# Altium schematic sheet P11_ETH1 RMII.SchDoc
size 420 x 297 mm
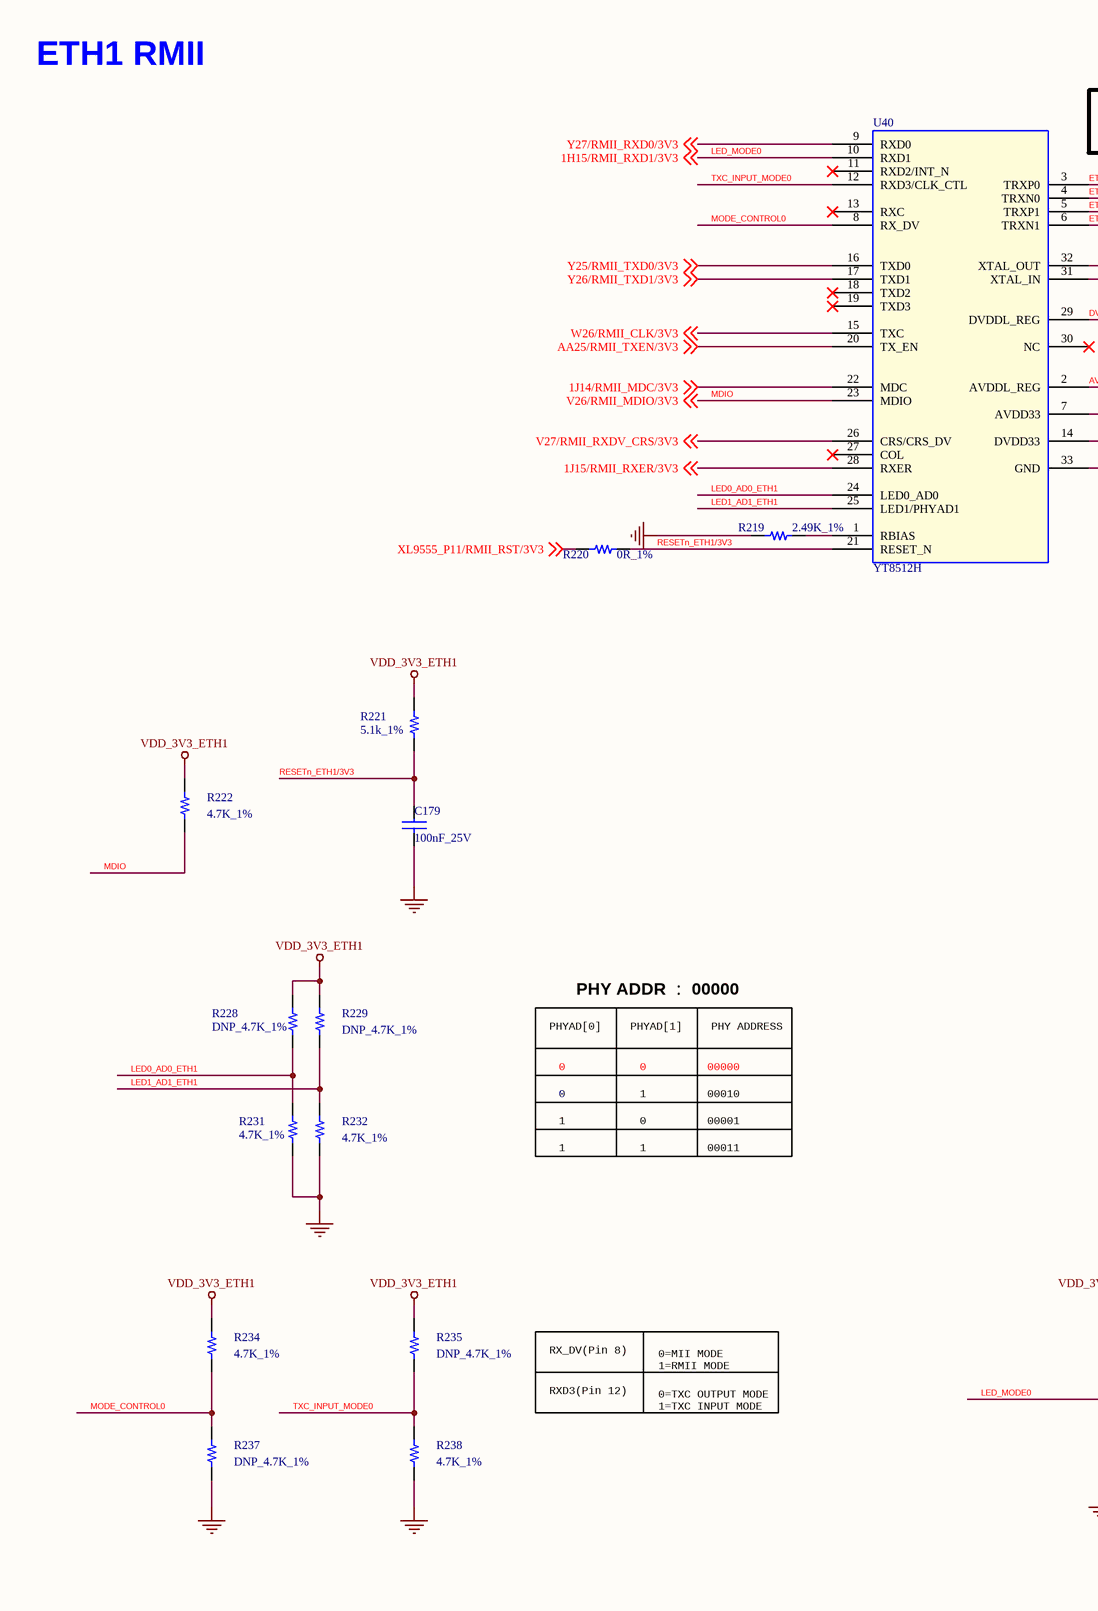
[diagram p0: P11_ETH1 RMII.SchDoc, left]
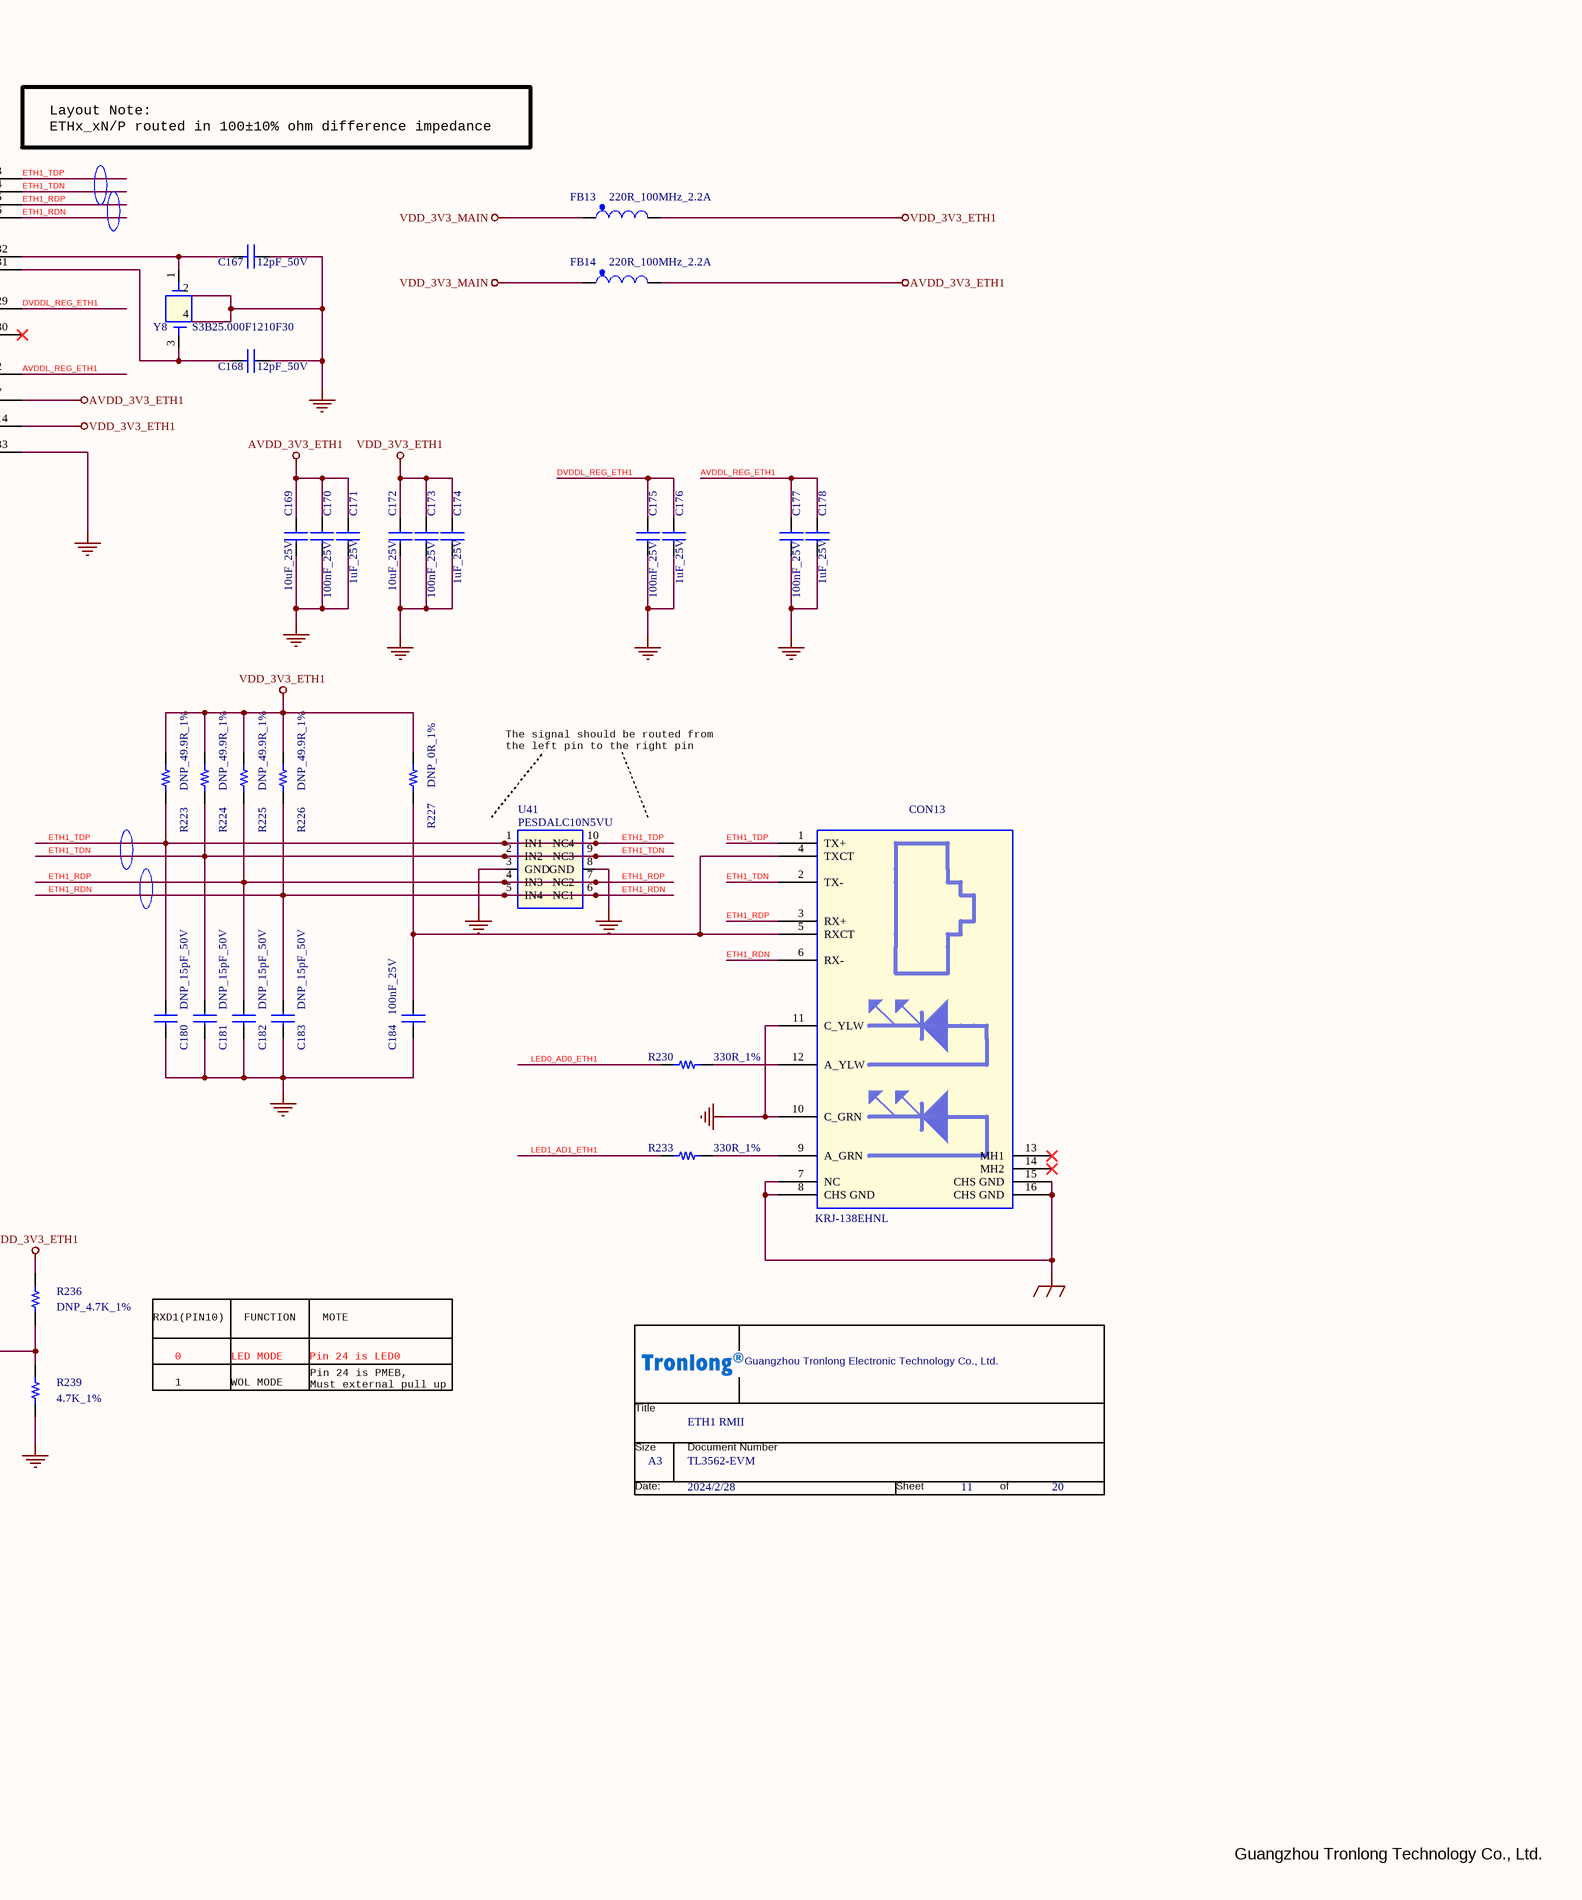
[diagram p1: P11_ETH1 RMII.SchDoc, right]

## Parts
*  Page Count: 20  Page Number: 11  Page Size: A3  OrgName: Guangzhou Tronlong Electronic Technology Co., Ltd.  Title: ETH1 RMII  Doc: TL3562-EVM  Page Modify Date: 2024/2/28  (hidden comment: Tronlong_TITTLE_20211115)  (graphical)
C167  12pF_50V  [C0402]
C168  12pF_50V  [C0402]
C169  10uF_25V  [C0603]
C170  100nF_25V  [C0402]
C171  1uF_25V  [C0603]
C172  10uF_25V  [C0603]
C173  100nF_25V  [C0402]
C174  1uF_25V  [C0603]
C175  100nF_25V  [C0402]
C176  1uF_25V  [C0603]
C177  100nF_25V  [C0402]
C178  1uF_25V  [C0603]
C179  100nF_25V  [C0402]
C180  DNP_15pF_50V  [C0603]
C181  DNP_15pF_50V  [C0603]
C182  DNP_15pF_50V  [C0603]
C183  DNP_15pF_50V  [C0603]
C184  100nF_25V  [C0402]
CON13  KRJ-138EHNL  [CON_YDS_13F-64GYD2PLXNL]
FB13  220R_100MHz_2.2A  [L0603]
FB14  220R_100MHz_2.2A  [L0603]
R219  2.49K_1%  [R0603]
R220  0R_1%  [R0402]
R221  5.1k_1%  [R0402]
R222  4.7K_1%  [R0402]
R223  DNP_49.9R_1%  [R0603]
R224  DNP_49.9R_1%  [R0603]
R225  DNP_49.9R_1%  [R0603]
R226  DNP_49.9R_1%  [R0603]
R227  DNP_0R_1%  [R0402]
R228  DNP_4.7K_1%  [R0402]
R229  DNP_4.7K_1%  [R0402]
R230  330R_1%  [R0402]
R231  4.7K_1%  [R0402]
R232  4.7K_1%  [R0402]
R233  330R_1%  [R0402]
R234  4.7K_1%  [R0402]
R235  DNP_4.7K_1%  [R0402]
R236  DNP_4.7K_1%  [R0402]
R237  DNP_4.7K_1%  [R0402]
R238  4.7K_1%  [R0402]
R239  4.7K_1%  [R0402]
U40  YT8512H  [QFN32]
U41  PESDALC10N5VU  [DFN-10-2510]
Y8  S3B25.000F1210F30  [SMD_3225]

## Nets
AVDD_3V3_ETH1: C169.1 C170.1 C171.1 FB14.2 U40.7(AVDD33)
EGND: CON13.7(NC) CON13.8(CHS_GND) CON13.15(CHS_GND) CON13.16(CHS_GND)
GND: C167.1 C168.1 C169.2 C170.2 C171.2 C172.2 C173.2 C174.2 C175.2 C176.2 C177.2 C178.2 C179.2 C180.2 C181.2 C182.2 C183.2 C184.2 CON13.10(C_GRN) CON13.11(C_YLW) R219.2 R231.1 R232.1 R237.2 R238.2 R239.2 U40.33(GND) U41.3(GND) U41.8(GND) Y8.2 Y8.4
VDD_3V3_ETH1: C172.1 C173.1 C174.1 FB13.2 R221.1 R222.1 R223.1 R224.1 R225.1 R226.1 R227.2 R228.2 R229.2 R234.2 R235.2 R236.2 U40.14(DVDD33)
VDD_3V3_MAIN: FB13.1 FB14.1
1J14/RMII_MDC/3V3: U40.22(MDC) ; off-sheet 1J14/RMII_MDC/3V3
1J15/RMII_RXER/3V3: U40.28(RXER) ; off-sheet 1J15/RMII_RXER/3V3
AA25/RMII_TXEN/3V3: U40.20(TX_EN) ; off-sheet AA25/RMII_TXEN/3V3
AVDDL_REG_ETH1: C177.1 C178.1 U40.2(AVDDL_REG)
DVDDL_REG_ETH1: C175.1 C176.1 U40.29(DVDDL_REG)
ETH1_RDN: C183.1 CON13.6(RX-) R226.2 U40.6(TRXN1) U41.5(IN4) U41.6(NC1)
ETH1_RDP: C182.1 CON13.3(RX+) R225.2 U40.5(TRXP1) U41.4(IN3) U41.7(NC2)
ETH1_TDN: C181.1 CON13.2(TX-) R224.2 U40.4(TRXN0) U41.2(IN2) U41.9(NC3)
ETH1_TDP: C180.1 CON13.1(TX+) R223.2 U40.3(TRXP0) U41.1(IN1) U41.10(NC4)
LED0_AD0_ETH1: R228.1 R230.1 R231.2 U40.24(LED0_AD0)
LED1_AD1_ETH1: R229.1 R232.2 R233.1 U40.25(LED1/PHYAD1)
LED_MODE0: R236.1 R239.1 U40.10(RXD1) ; off-sheet 1H15/RMII_RXD1/3V3  [also labelled 1H15/RMII_RXD1/3V3]
MDIO: R222.2 U40.23(MDIO) ; off-sheet V26/RMII_MDIO/3V3  [also labelled V26/RMII_MDIO/3V3]
MODE_CONTROL0: R234.1 R237.1 U40.8(RX_DV)
RESETn_ETH1/3V3: C179.1 R220.2 R221.2 U40.21(RESET_N)
TXC_INPUT_MODE0: R235.1 R238.1 U40.12(RXD3/CLK_CTL)
V27/RMII_RXDV_CRS/3V3: U40.26(CRS/CRS_DV) ; off-sheet V27/RMII_RXDV_CRS/3V3
W26/RMII_CLK/3V3: U40.15(TXC) ; off-sheet W26/RMII_CLK/3V3
XL9555_P11/RMII_RST/3V3: R220.1 ; off-sheet XL9555_P11/RMII_RST/3V3
Y25/RMII_TXD0/3V3: U40.16(TXD0) ; off-sheet Y25/RMII_TXD0/3V3
Y26/RMII_TXD1/3V3: U40.17(TXD1) ; off-sheet Y26/RMII_TXD1/3V3
Y27/RMII_RXD0/3V3: U40.9(RXD0) ; off-sheet Y27/RMII_RXD0/3V3
NetC167_2: C167.2 U40.32(XTAL_OUT) Y8.1
NetC168_2: C168.2 U40.31(XTAL_IN) Y8.3
NetC184_1: C184.1 CON13.4(TXCT) CON13.5(RXCT) R227.1
NetCON13_9: CON13.9(A_GRN) R233.2
NetCON13_12: CON13.12(A_YLW) R230.2
NetR219_1: R219.1 U40.1(RBIAS)

Not connected (* = marked no-connect by the designer): CON13 13(MH1)* 14(MH2)*; U40 11(RXD2/INT_N)* 13(RXC)* 18(TXD2)* 19(TXD3)* 27(COL)* 30(NC)*

## Notes on the sheet
- ETH1 RMII
- Layout Note:
  ETHx_xN/P routed in 100±10% ohm difference impedance
- The signal should be routed from
  the left pin to the right pin
- PHYAD[0]
- PHY ADDR ： 00000
- PHYAD[1]
- PHY ADDRESS
- 0
- 1
- 00000
- 00010
- 00001
- 00011
- RX_DV(Pin 8)
- 0=MII MODE
  1=RMII MODE
- RXD1(PIN10)
- FUNCTION
- MOTE
- RXD3(Pin 12)
- 0=TXC OUTPUT MODE
  1=TXC INPUT MODE
- LED MODE
- WOL MODE
- Pin 24 is LED0
- Pin 24 is PMEB,
  Must external pull up
- Guangzhou Tronlong Technology Co., Ltd.
- (in symbol Tronlong_TITTLE_20211115) Title; Size; Document Number; Date:; Sheet; of

## Library data of the parts
* = Tronlong_TITTLE_20211115: RevCode: A?; Page Create Date: March  8, 1995
C167 = CAP NP_2: 贴片陶瓷电容,12pF,5%,50V,COG; Manufacturer Character: 中国大陆; room: 10; Operation Temperature（℃）: -55~125℃; As-Welded: /; PCB Footprint: C0402
C168 = CAP NP_2: 贴片陶瓷电容,12pF,5%,50V,COG; Manufacturer Character: 中国大陆; As-Welded: /; Operation Temperature（℃）: -55~125℃; room: 10; PCB Footprint: C0402
C169 C172 = CAP NP_2: 贴片陶瓷电容,10uF,10%,10V,X5R; Manufacturer Character: 中国大陆; room: 10; Operation Temperature（℃）: -55~85℃; As-Welded: /; PCB Footprint: C0603
C170 C173 C175 C177 = CAP NP_2: 贴片陶瓷电容,100nF,10%,25V,X5R; Manufacturer Character: 中国大陆; As-Welded: /; room: 10; Operation Temperature（℃）: -55~85℃; PCB Footprint: C0402
C171 C176 C178 = CAP NP_2: 贴片陶瓷电容,1uF,10%,25V,X5R; Manufacturer Character: 中国大陆; As-Welded: /; room: 10; Operation Temperature（℃）: -55~85℃; PCB Footprint: C0603
C174 = CAP NP_2: 贴片陶瓷电容,1uF,10%,25V,X5R; Manufacturer Character: 中国大陆; As-Welded: /; Operation Temperature（℃）: -55~85℃; room: 10; PCB Footprint: C0603
C179 = CAP NP_2: 贴片陶瓷电容,100nF,10%,25V,X5R; Manufacturer Character: 中国大陆; As-Welded: /; Operation Temperature（℃）: -55~85℃; room: 10; PCB Footprint: C0402
C180 = CAP NP_3: 贴片陶瓷电容,15pF,5%,50V,COG; Manufacturer Character: 中国大陆; As-Welded: DNP; room: ecat1; Operation Temperature（℃）: -55~125℃; Temperature: -55~125℃; PCB Footprint: C0603
C181-C183 = CAP NP_3: 贴片陶瓷电容,15pF,5%,50V,COG; Manufacturer Character: 中国大陆; Operation Temperature（℃）: -55~125℃; room: ecat1; As-Welded: DNP; Temperature: -55~125℃; PCB Footprint: C0603
C184 = CAP NP_3: 贴片陶瓷电容,100nF,10%,25V,X5R; Manufacturer Character: 中国大陆; As-Welded: /; room: ecat1; Operation Temperature（℃）: -55~85℃; Temperature: -55~125℃; PCB Footprint: C0402
CON13 = ETHERNET CONNECTER: RJ45连接器,12PIN,90度,母座,插件; Manufacturer Character: 中国大陆; Manufacturer: 东莞市科优达电子科技有限公司（DGKYD）; As-Welded: /; room: ecat1; Operation Temperature（℃）: -40~85℃; Manufacturer PartNumber: KRJ-138EHNL; Manufacturer Part Number: KRJ-138EHNL; Temperature: -40~85℃; PCB Footprint: CON_YDS_13F-64GYD2PLXNL
FB13 = FERRITE BEAD_Dup2: 磁珠,50mΩ,2.2A,220R@100MHz; Manufacturer PartNumber: UPZ1608U221-2R2TF; Manufacturer: 深圳顺络电子股份有限公司（Sunlord）; Manufacturer Character: 中国大陆; As-Welded: /; Operation Temperature（℃）: -55~125℃; Temperature: -40~85℃; PCB Footprint: L0603
FB14 = FERRITE BEAD_Dup2: 磁珠,50mΩ,2.2A,220R@100MHz; Manufacturer: 深圳顺络电子股份有限公司（Sunlord）; Manufacturer PartNumber: UPZ1608U221-2R2TF; Manufacturer Character: 中国大陆; As-Welded: /; Operation Temperature（℃）: -55~125℃; Temperature: -40~85℃; PCB Footprint: L0603
R219 = R_1: 贴片电阻,2.49K,±1%,1/10W; Manufacturer Character: 中国大陆; As-Welded: /; room: USB HUB; Operation Temperature（℃）: -55~155℃; PCB Footprint: R0603
R220 = R_1: 0R,±1%,R0402,≥1/16W; Manufacturer Character: 中国大陆; As-Welded: /; Operation Temperature（℃）: -55~155℃; room: USB HUB; PCB Footprint: R0402
R221 = R 1%: 贴片电阻,5.1K,±1%,1/16W; Manufacturer Character: 中国大陆; Characteristic: 0402 1/16W +/-1%; CLASS: DISCRETE; As-Welded: /; room: JTAG; Operation Temperature（℃）: -55~155℃; Temperature: -55~125℃; PCB Footprint: R0402
R222 R231 R232 R239 = R_1: 贴片电阻,4.7K,±1%,1/16W; Manufacturer Character: 中国大陆; As-Welded: /; room: DRDUSB; Operation Temperature（℃）: -55~155℃; PCB Footprint: R0402
R223 = R_0: 贴片电阻,49.9R,±1%,1/10W; Manufacturer Character: 中国大陆; room: ecat1; As-Welded: DNP; Operation Temperature（℃）: -40~85℃; PCB Footprint: R0603; Temperature: -55~155℃
R224-R226 = R_0: 贴片电阻,49.9R,±1%,1/10W; Manufacturer Character: 中国大陆; Operation Temperature（℃）: -40~85℃; As-Welded: DNP; room: ecat1; Temperature: -55~155℃; PCB Footprint: R0603
R227 = R_0: 贴片电阻,0R,±1%,1/16W; Manufacturer Character: 中国大陆; Operation Temperature（℃）: -55~155℃; As-Welded: DNP; room: ecat1; Temperature: -55~155℃; PCB Footprint: R0402
R228 R229 R236 R237 = R_1: 贴片电阻,4.7K,±1%,1/16W; Manufacturer Character: 中国大陆; Operation Temperature（℃）: -55~155℃; As-Welded: DNP; room: DRDUSB; PCB Footprint: R0402
R230 R233 = R_0: 贴片电阻,330R,±1%,1/16W; Manufacturer Character: 中国大陆; As-Welded: /; room: ecat1; Operation Temperature（℃）: -55~155℃; Temperature: –55~155℃; PCB Footprint: R0402
R234 = R_1: 贴片电阻,4.7K,±1%,1/16W; Manufacturer Character: 中国大陆; Operation Temperature（℃）: -55~155℃; room: DRDUSB; As-Welded: /; PCB Footprint: R0402
R235 = R_1: 贴片电阻,4.7K,±1%,1/16W; Manufacturer Character: 中国大陆; Operation Temperature（℃）: -55~155℃; room: DRDUSB; As-Welded: DNP; PCB Footprint: R0402
R238 = R_1: 贴片电阻,4.7K,±1%,1/16W; Manufacturer Character: 中国大陆; room: DRDUSB; As-Welded: /; Operation Temperature（℃）: -55~155℃; PCB Footprint: R0402
U40 = YT8512H_1: 以太网收发器，MII/RMII; Manufacturer Character: 中国大陆; Manufacturer: 苏州裕太微电子有限公司（Motorcomm）; Operation Temperature（℃）: -40~85℃; As-Welded: /; Temperature: -40~85℃; Manufacturer PartNumber: YT8512H; PCB Footprint: QFN32
U41 = SU099PGTR: 4通道超低电容瞬态抑制器; Manufacturer Character: 中国大陆; Manufacturer: 上海芯导电子科技有限公司（Prisemi）; Operation Temperature（℃）: -40~85℃; As-Welded: /; Temperature: -55~150; Manufacturer PartNumber: PESDALC10N5VU; PCB Footprint: DFN-10-2510
Y8 = CRYSTAL-4 PIN: 四脚无源晶振,25MHz,±10ppm,12pF,30Ω,±30ppm; Manufacturer Character: 中国大陆; Manufacturer: 深圳市星通时频电子有限公司公司（JSCJ）; As-Welded: /; Operation Temperature（℃）: -40~85℃; Manufacturer PartNumber: S3B25.000F1210F30; Temperature: -40~85℃; PCB Footprint: SMD_3225